# EAGLE schematic ControlBoard (EAGLE 7.0.0)
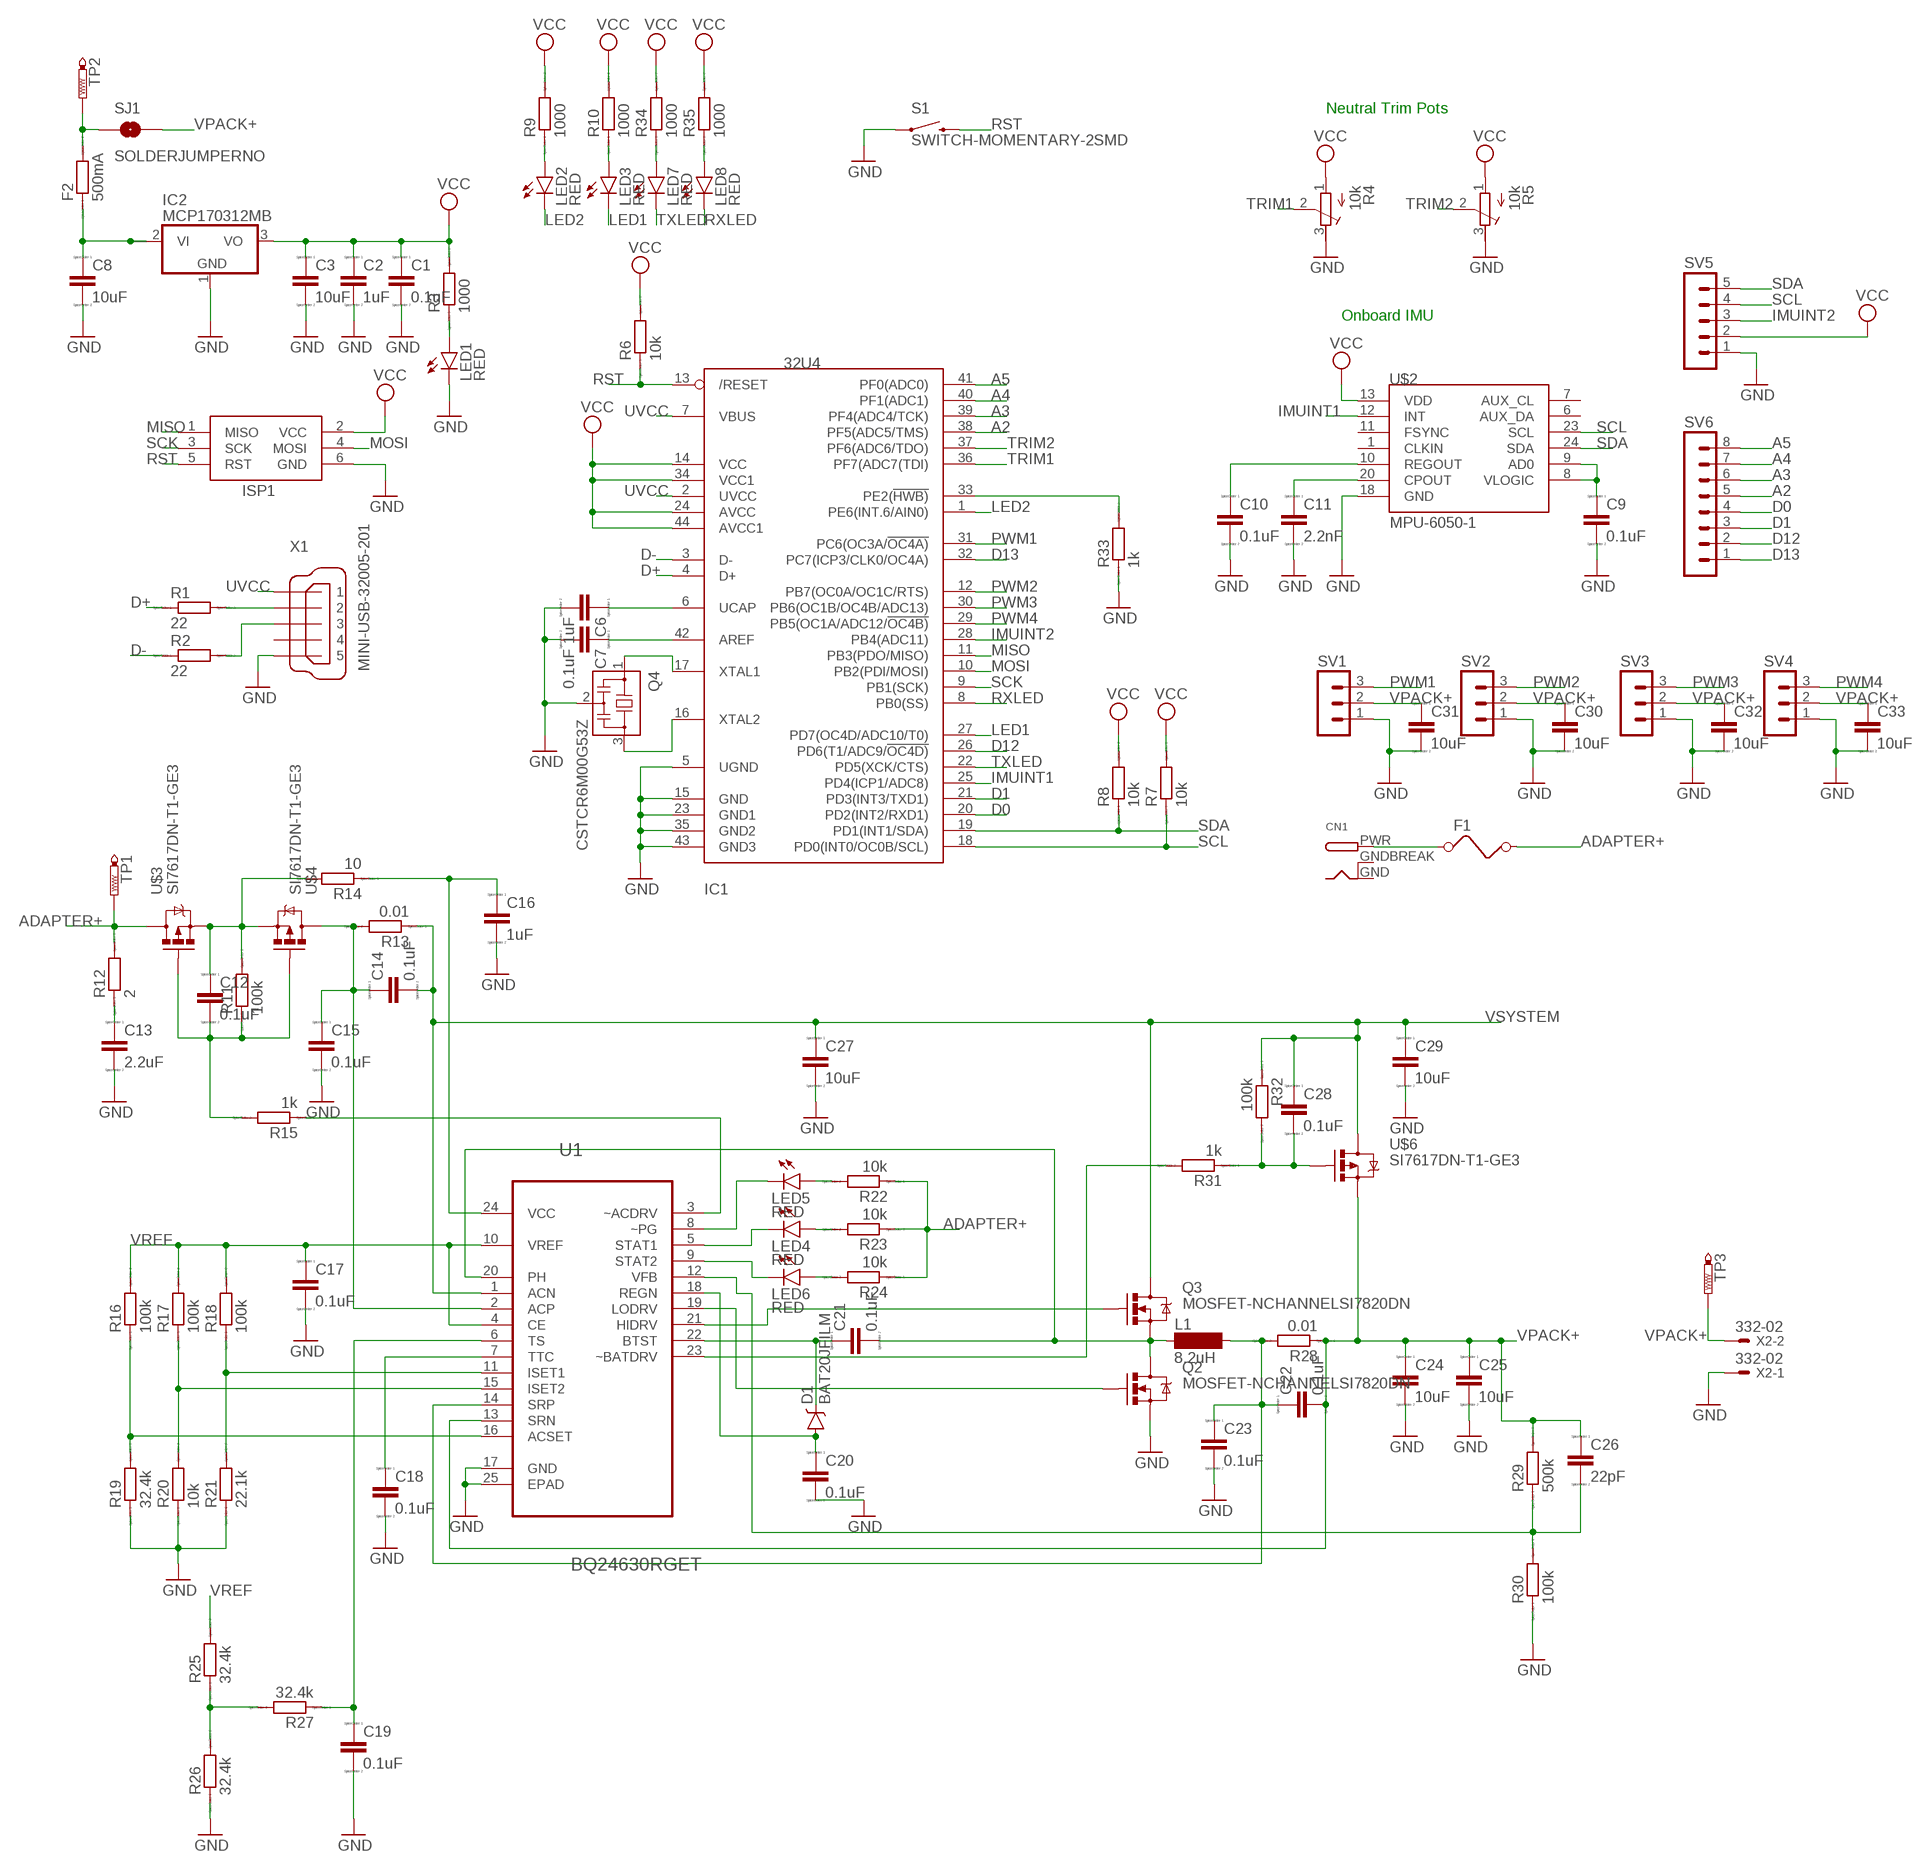
[diagram p0: schematic, sheet 1]

## Parts
C1  0.1uF  CC0603  [C0603]
C2  1uF  CC0603  [C0603]
C3  10uF  CC0603  [C0603]
C6  1uF  CC0603  [C0603]
C7  0.1uF  CC0603  [C0603]
C8  10uF  CC0603  [C0603]
C9  0.1uF  CC0603  [C0603]
C10  0.1uF  CC0603  [C0603]
C11  2.2nF  CC0603  [C0603]
C12  0.1uF  CC0603  [C0603]
C13  2.2uF  CC0603  [C0603]
C14  0.1uF  CC0603  [C0603]
C15  0.1uF  CC0603  [C0603]
C16  1uF  CC0603  [C0603]
C17  0.1uF  CC0603  [C0603]
C18  0.1uF  CC0603  [C0603]
C19  0.1uF  CC0603  [C0603]
C20  0.1uF  CC0603  [C0603]
C21  0.1uF  CC0603  [C0603]
C22  0.1uF  CC0603  [C0603]
C23  0.1uF  CC0603  [C0603]
C24  10uF  CC0603  [C0603]
C25  10uF  CC0603  [C0603]
C26  22pF  CC0603  [C0603]
C27  10uF  CC0603  [C0603]
C28  0.1uF  CC0603  [C0603]
C29  10uF  CC0603  [C0603]
C30  10uF  CC0603  [C0603]
C31  10uF  CC0603  [C0603]
C32  10uF  CC0603  [C0603]
C33  10uF  CC0603  [C0603]
CN1  DCBARRELPTH  [DCJACK_2MM_PTH]
D1  BAT20JFILM  [SOD-323]
F1  FUSE  [FUSE]
F2  500mA  RR0603  [R0603]
IC1  32U4  ATMEGA32U4-AU  [TQFP44]
IC2  MCP170312MB  [SOT89]
ISP1  AVRISP-6  [AVRISP]
L1  8.2uH  SM-1206  [SM-1206]
LED1  RED  LED1206  [LED-1206]
LED2  RED  LED1206  [LED-1206]
LED3  RED  LED1206  [LED-1206]
LED4  RED  LED1206  [LED-1206]
LED5  RED  LED1206  [LED-1206]
LED6  RED  LED1206  [LED-1206]
LED7  RED  LED1206  [LED-1206]
LED8  RED  LED1206  [LED-1206]
Q2  MOSFET-NCHANNELSI7820DN  [POWERPAK1212-8]
Q3  MOSFET-NCHANNELSI7820DN  [POWERPAK1212-8]
Q4  CSTCR6M00G53Z  [CSTCR6M]
R1  22  RR0603  [R0603]
R2  22  RR0603  [R0603]
R3  1000  RR0603  [R0603]
R4  10k  R-TRIMM3299W  [RTRIM3299W]
R5  10k  R-TRIMM3299W  [RTRIM3299W]
R6  10k  RR0603  [R0603]
R7  10k  RR0603  [R0603]
R8  10k  RR0603  [R0603]
R9  1000  RR0603  [R0603]
R10  1000  RR0603  [R0603]
R11  100k  RR0603  [R0603]
R12  2  RR0603  [R0603]
R13  0.01  RR0603  [R0603]
R14  10  RR0603  [R0603]
R15  1k  RR0603  [R0603]
R16  100k  RR0603  [R0603]
R17  100k  RR0603  [R0603]
R18  100k  RR0603  [R0603]
R19  32.4k  RR0603  [R0603]
R20  10k  RR0603  [R0603]
R21  22.1k  RR0603  [R0603]
R22  10k  RR0603  [R0603]
R23  10k  RR0603  [R0603]
R24  10k  RR0603  [R0603]
R25  32.4k  RR0603  [R0603]
R26  32.4k  RR0603  [R0603]
R27  32.4k  RR0603  [R0603]
R28  0.01  RR0603  [R0603]
R29  500k  RR0603  [R0603]
R30  100k  RR0603  [R0603]
R31  1k  RR0603  [R0603]
R32  100k  RR0603  [R0603]
R33  1k  RR0603  [R0603]
R34  1000  RR0603  [R0603]
R35  1000  RR0603  [R0603]
S1  SWITCH-MOMENTARY-2SMD  [TACTILE-SWITCH-SMD]
SJ1  SOLDERJUMPERNO  [SJ_2S-NO]
SV1  MA03-1  [MA03-1]
SV2  MA03-1  [MA03-1]
SV3  MA03-1  [MA03-1]
SV4  MA03-1  [MA03-1]
SV5  MA05-1  [MA05-1]
SV6  MA08-1  [MA08-1]
TP1  PTR1PAD1-13  [P1-13]
TP2  PTR1PAD1-13  [P1-13]
TP3  PTR1PAD1-13  [P1-13]
U1  BQ24630RGET  [QFN50P400X400X100-25N]
U$2  MPU-6050-1  [QFN-24-4MM2]
U$3  SI7617DN-T1-GE3  [POWERPAK1212-8]
U$4  SI7617DN-T1-GE3  [POWERPAK1212-8]
U$6  SI7617DN-T1-GE3  [POWERPAK1212-8]
X1  MINI-USB-32005-201  [32005-201]
X2  332-02  [332-02]

## Nets
A2: IC1.38(PF5(ADC5/TMS)) SV6.5
A3: IC1.39(PF4(ADC4/TCK)) SV6.6
A4: IC1.40(PF1(ADC1)) SV6.7
A5: IC1.41(PF0(ADC0)) SV6.8
ADAPTER+: F1.2 R12.2 R22.1 R23.1 R24.1 TP1.TP U$3.D1(D) U$3.D2(D) U$3.D3(D) U$3.D4(D) U$3.DPAD(D)
D0: IC1.20(PD2(INT2/RXD1)) SV6.4
D1: IC1.21(PD3(INT3/TXD1)) SV6.3
D12: IC1.26(PD6(T1/ADC9/!OC4D)) SV6.2
D13: IC1.32(PC7(ICP3/CLK0/OC4A)) SV6.1
D+: IC1.4(D+) R1.1
D-: IC1.3(D-) R2.1
GND: C1.2 C2.2 C3.2 C6.2 C7.2 C8.2 C9.2 C10.2 C11.2 C13.2 C15.2 C16.2 C17.2 C18.2 C19.2 C20.2 C23.2 C24.2 C25.2 C27.2 C29.2 C30.2 C31.2 C32.2 C33.2 IC1.5(UGND) IC1.15(GND) IC1.23(GND1) IC1.35(GND2) IC1.43(GND3) IC2.1(GND) ISP1.6(GND) LED1.C Q2.S1(S) Q2.S2(S) Q2.S3(S) Q4.2 R4.3(E) R5.3(E) R19.1 R20.1 R21.1 R26.1 R30.1 R33.1 S1.1 SV1.1 SV2.1 SV3.1 SV4.1 SV5.1 U1.17(GND) U1.25(EPAD) U$2.18(GND) X1.5 X2.1
IMUINT1: IC1.25(PD4(ICP1/ADC8)) U$2.12(INT)
IMUINT2: IC1.28(PB4(ADC11)) SV5.3
LED1: IC1.27(PD7(OC4D/ADC10/T0)) LED3.C
LED2: IC1.1(PE6(INT.6/AIN0)) LED2.C
MISO: IC1.11(PB3(PDO/MISO)) ISP1.1(MISO)
MOSI: IC1.10(PB2(PDI/MOSI)) ISP1.4(MOSI)
N$1: IC1.16(XTAL2) Q4.3
N$2: IC1.17(XTAL1) Q4.1
N$3: R2.2 X1.3
N$4: C6.1 IC1.6(UCAP)
N$5: C7.1 IC1.42(AREF)
N$6: C8.1 F2.1 IC2.2(VI) IC2.2@1(VI1)
N$7: C9.1 U$2.8(VLOGIC) U$2.9(AD0)
N$8: C11.1 U$2.20(CPOUT)
N$9: R1.2 X1.2
N$10: C10.1 U$2.10(REGOUT)
N$11: LED1.A R3.1
N$12: LED3.A R10.1
N$13: LED2.A R9.1
N$14: C12.1 R11.2 R14.2 U$3.S1(S) U$3.S2(S) U$3.S3(S) U$4.S1(S) U$4.S2(S) U$4.S3(S)
N$15: C12.2 R11.1 R15.2 U$3.G U$4.G
N$16: C13.1 R12.1
N$17: C14.1 C15.1 R13.2 U1.2(ACP) U$4.D1(D) U$4.D2(D) U$4.D3(D) U$4.D4(D) U$4.DPAD(D)
N$19: R15.1 U1.3(~ACDRV)
N$20: C16.1 R14.1 U1.24(VCC)
N$21: R16.1 R19.2 U1.16(ACSET)
N$22: R17.1 R20.2 U1.15(ISET2)
N$23: R18.1 R21.2 U1.11(ISET1)
N$24: C18.1 U1.7(TTC)
N$25: C19.1 R27.1 U1.6(TS)
N$26: LED5.C U1.8(~PG)
N$27: LED4.C U1.5(STAT1)
N$28: LED6.C U1.9(STAT2)
N$29: LED6.A R24.2
N$30: LED4.A R23.2
N$31: LED5.A R22.2
N$32: R25.1 R26.2 R27.2
N$33: C21.1 D1.C U1.22(BTST)
N$34: C20.1 D1.A U1.18(REGN)
N$35: C21.2 L1.1 Q2.D1(D) Q2.D2(D) Q2.D3(D) Q2.D4(D) Q2.DPAD(D) Q3.S1(S) Q3.S2(S) Q3.S3(S) U1.20(PH)
N$36: Q2.G U1.19(LODRV)
N$37: Q3.G U1.21(HIDRV)
N$38: C26.2 R29.1 R30.2 U1.12(VFB)
N$39: R31.2 U1.23(~BATDRV)
N$40: C28.2 R31.1 R32.2 U$6.G
N$41: C22.1 C23.1 L1.2 R28.2 U1.14(SRP)
N$43: CN1.PWR F1.1
N$44: F2.2 SJ1.1 TP2.TP
N$45: LED7.A R34.1
N$46: LED8.A R35.1
N$49: IC1.33(PE2(!HWB)) R33.2
PWM1: IC1.31(PC6(OC3A/!OC4A)) SV1.3
PWM2: IC1.12(PB7(OC0A/OC1C/RTS)) SV2.3
PWM3: IC1.30(PB6(OC1B/OC4B/ADC13)) SV3.3
PWM4: IC1.29(PB5(OC1A/ADC12/!OC4B)) SV4.3
RST: IC1.13(/RESET) ISP1.5(RST) R6.1 S1.3
RXLED: IC1.8(PB0(SS)) LED8.C
SCK: IC1.9(PB1(SCK)) ISP1.3(SCK)
SCL: IC1.18(PD0(INT0/OC0B/SCL)) R7.1 SV5.4 U$2.23(SCL)
SDA: IC1.19(PD1(INT1/SDA)) R8.1 SV5.5 U$2.24(SDA)
TRIM1: IC1.36(PF7(ADC7(TDI)) R4.2(S)
TRIM2: IC1.37(PF6(ADC6/TDO)) R5.2(S)
TXLED: IC1.22(PD5(XCK/CTS)) LED7.C
UVCC: IC1.2(UVCC) IC1.7(VBUS) X1.1
VCC: C1.1 C2.1 C3.1 IC1.14(VCC) IC1.24(AVCC) IC1.34(VCC1) IC1.44(AVCC1) IC2.3(VO) ISP1.2(VCC) R3.2 R4.1(A) R5.1(A) R6.2 R7.2 R8.2 R9.2 R10.2 R34.2 R35.2 SV5.2 U$2.13(VDD)
VPACK+: C22.2 C24.1 C25.1 C26.1 C30.1 C31.1 C32.1 C33.1 R28.1 R29.2 SJ1.2 SV1.2 SV2.2 SV3.2 SV4.2 TP3.TP U1.13(SRN) U$6.S1(S) U$6.S2(S) U$6.S3(S) X2.2
VREF: C17.1 R16.2 R17.2 R18.2 R25.2 U1.4(CE) U1.10(VREF)
VSYSTEM: C14.2 C27.1 C28.1 C29.1 Q3.D1(D) Q3.D2(D) Q3.D3(D) Q3.D4(D) Q3.DPAD(D) R13.1 R32.1 U1.1(ACN) U$6.D1(D) U$6.D2(D) U$6.D3(D) U$6.D4(D) U$6.DPAD(D)
Unconnected: U$2.1(CLKIN) U$2.6(AUX_DA) U$2.7(AUX_CL) U$2.11(FSYNC) X1.4

## Notes on the sheet
- Neutral Trim Pots
- Onboard IMU

## Power pins joined to a net without a drawn wire
GND: CN1.GND
GNDBREAK: CN1.GNDBREAK

## Library data of the parts
C1-C3 C6-C33 = eagle-ltspice:C: CAPACITOR, European symbol; SPICEMODEL: NONE; SPICEPREFIX: C
CN1 = adafruit:DCBARREL: 2.0mm DC Barrel Jack DCJACK_2MM_PTH - Through Hole Jack (4UConnector: 05537)
D1 = SparkFun-DiscreteSemi:BAT20JFILM: 23V, 1A Schottky diode, SOD-323 package; PROD_ID: DIO-11623
F1 = special:FUSE: FUSE 5 x 20 mm
F2 R1-R3 R6-R35 = eagle-ltspice:R: RESISTOR, European symbol; SPICEMODEL: NONE; SPICEPREFIX: R
IC1 = adafruit:ATMEGA32U4: http://www.ladyada.net/library/eagle
IC2 = linear:MCP1703*: 250 mA, 16V, Low Quiescent Current LDO Regulator Source: http://ww1.microchip.com/downloads/en/DeviceDoc/22049b.pdf
ISP1 = adafruit:AVRISP: AVR ISP HEADER Standard 6 pin header for AVR programming
L1 = inductor-neosid:SM-1206: INDUCTOR SMD chip inductor; OC_FARNELL: unknown; OC_NEWARK: unknown
LED1-LED8 = SparkFun-LED:LED: LEDs Standard schematic elements and footprints for 5mm, 3mm, 1206, and 0603 sized LEDs. 5mm - Spark Fun Electronics SKU : COM-00529 (and others)
Q2 Q3 = SparkFun-DiscreteSemi:MOSFET-NCHANNEL: Common NMOSFET Parts MFG P/N Store ID Prod ID FDD8780 TRANS-09984 SI7820DN TRANS-11055 FDS6630A IC-08089 2N7002PW TRANS-11151 FQP30N06L COM-10213 TRANS-10060 BSS123LT1G TRANS-08345 BSS138 TRANS-00830 BS170 2N7000; PROD_ID: TRANS-11055
Q4 = murata-filter:CSTCR: Resonator Source: murata.co.jp; MPN: CSTCR6M00G53-R0; OC_FARNELL: 1170434; OC_NEWARK: 25M8759
R4 R5 = rcl:R-TRIMM: Trimm resistor
S1 = SparkFun-Electromechanical:SWITCH-MOMENTARY-2: Various NO switches- pushbuttons, reed, etc; PROD_ID: SWCH-08247
SJ1 = SparkFun:SOLDERJUMPER: Solder Jumper Standard SMD solder jumper. Used to automate production. Two varients : Normally Open and Normally Closed are the same, but have different paste layers. NC will have a large amount of paste and should jumper during reflow.
SV1-SV4 = con-lstb:MA03-1: PIN HEADER; OC_FARNELL: unknown; OC_NEWARK: unknown
SV5 = con-lstb:MA05-1: PIN HEADER; OC_FARNELL: unknown; OC_NEWARK: unknown
SV6 = con-lstb:MA08-1: PIN HEADER; OC_FARNELL: unknown; OC_NEWARK: unknown
TP1-TP3 = testpad:PTR1: TEST PIN
U1 = Texas Instruments_By_element14_Batch_1:BQ24630RGET: Lithium Phosphate Battery Charger; MPN: BQ24630RGET; OC_FARNELL: 1815719; OC_NEWARK: 63R8367; PACKAGE: VQFN-24; SUPPLIER: Texas Instruments
U$2 = Testing:MPU-6050
U$3 U$4 U$6 = SparkFun-DiscreteSemi:SI7617DN-T1-GE3
X1 = con-cypressindustries:MINI-USB-: MINI USB-B Conector Source: www.cypressindustries.com; OC_FARNELL: unknown; OC_NEWARK: unknown
X2 = con-garry:332-02: 2 Pin - 2mm Dual Row Source: www.mpe-connector.de / garry_shortform_2012.pdf